# EAGLE design tinyShield (EAGLE 6.5.0)
PART_NUM: EPTIS01401; REV: B; TITLE: tinyISPShield
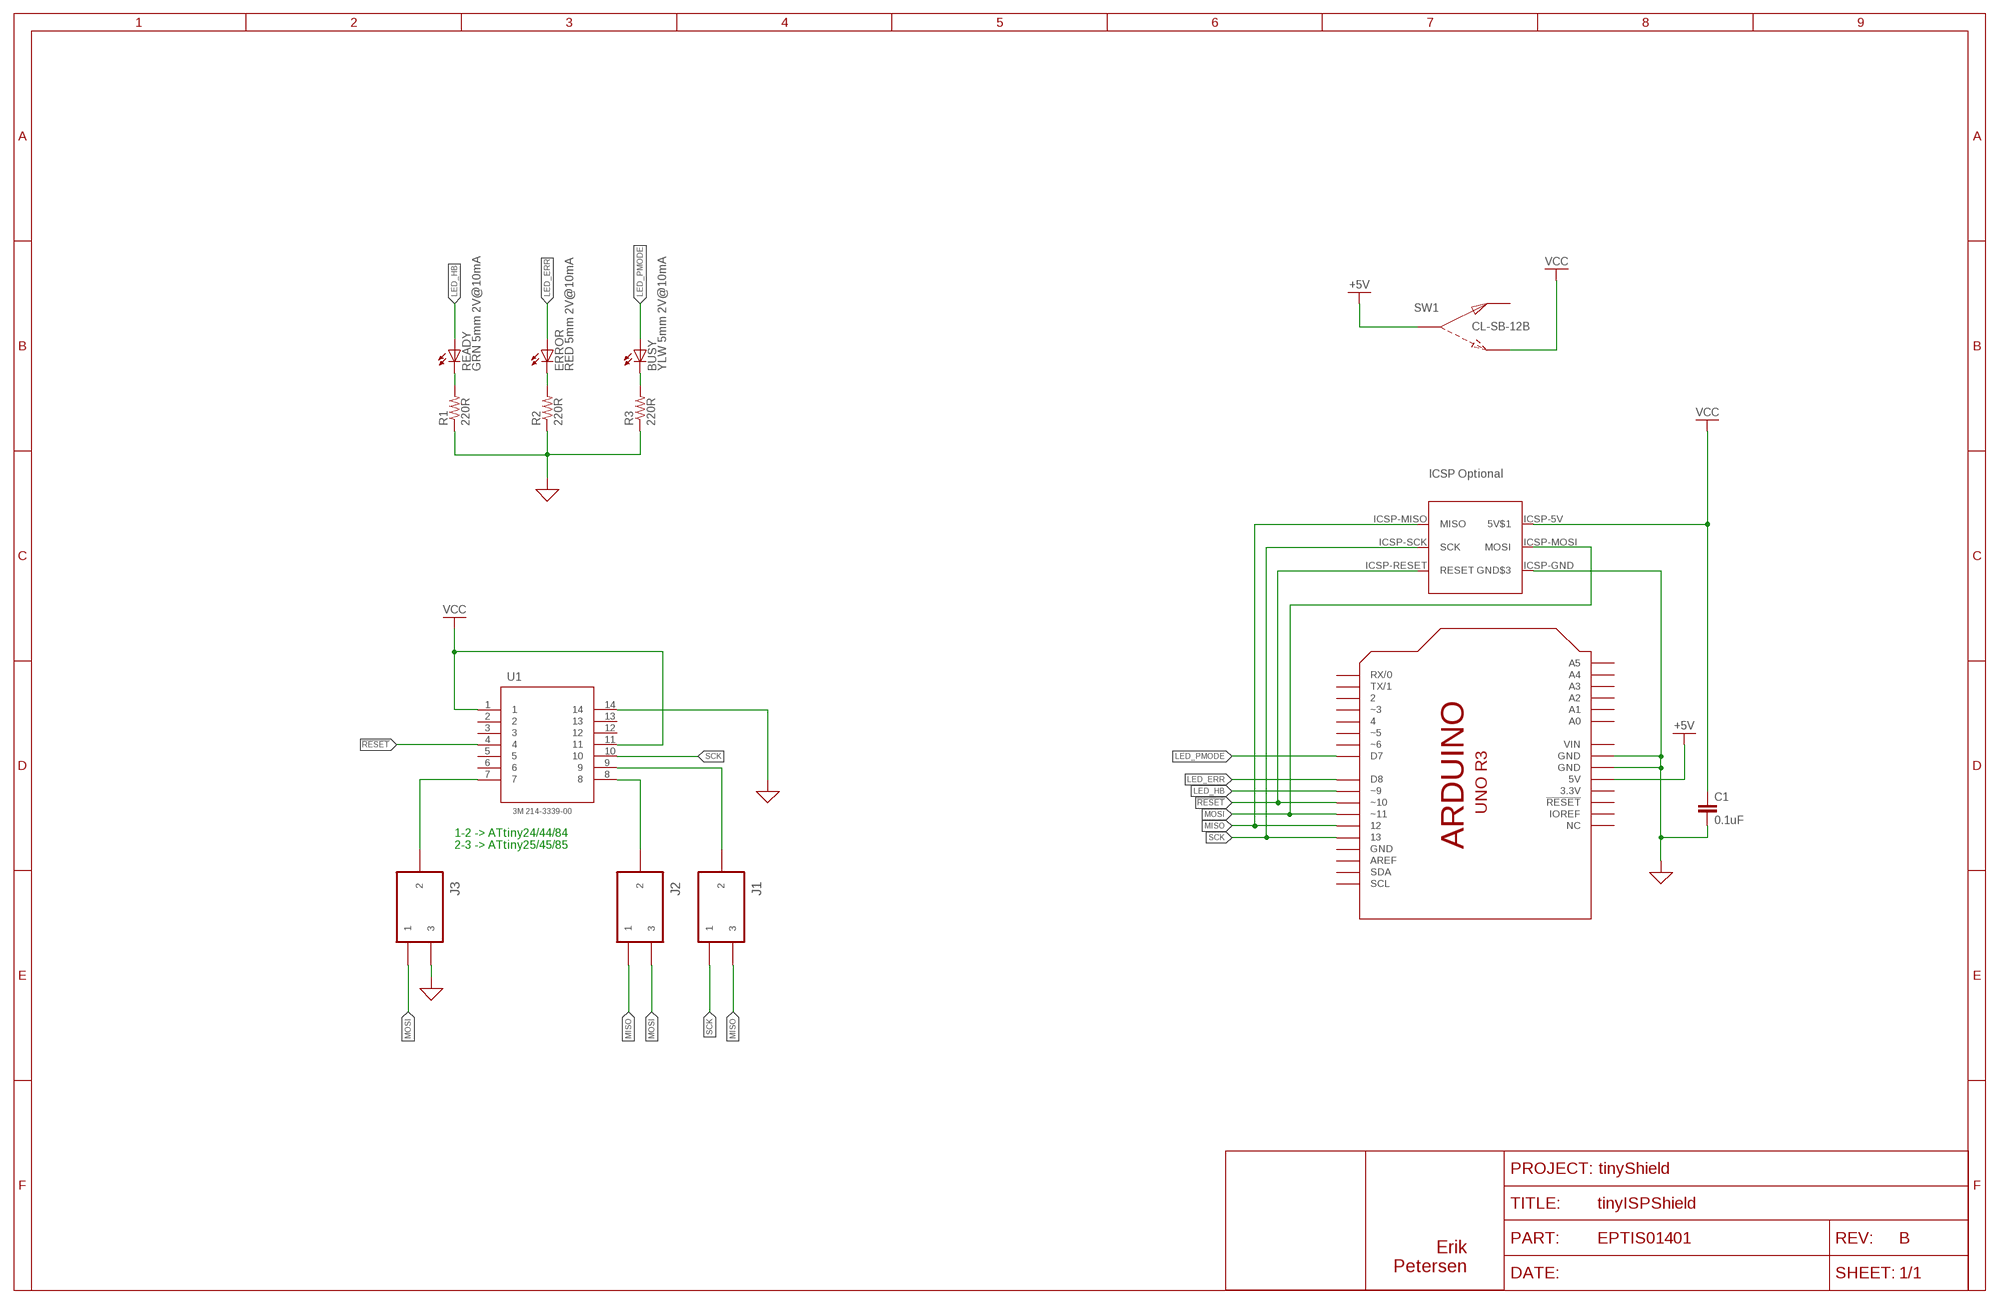
[diagram p0: schematic, sheet 1]

## Parts
BUSY  YLW 5mm 2V@10mA  LED5MM  [LED5MM]
C1  0.1uF  CAPPTH  [CAP-PTH-SMALL]
ERROR  RED 5mm 2V@10mA  LED5MM  [LED5MM]
J1  TSW-103-07-L-SNO_SILK  [1X03_NO_SILK]
J2  TSW-103-07-L-SNO_SILK  [1X03_NO_SILK]
J3  TSW-103-07-L-SNO_SILK  [1X03_NO_SILK]
R1  220R  R-US_0207/10  [0207/10]
R2  220R  R-US_0207/10  [0207/10]
R3  220R  R-US_0207/10  [0207/10]
READY  GRN 5mm 2V@10mA  LED5MM  [LED5MM]
SW1  CL-SB-12B  [CL-SB-12B]
U1  3M 214-3339-00  3M-214-3339  [3M_214_3339]
U$8  ARDUINO_R3_SHIELD  [ARDUINO_SHIELD]

## Nets
!RESET: U1.4 U$8.10(SHIELD:~10) U$8.ICSP-RESET(ICSP:RESET)
+5V: SW1.C U$8.5V(SHIELD:5V)
GND: C1.2 J3.3 R1.1 R2.1 R3.1 U1.14 U$8.GND$2(SHIELD:GND) U$8.GND$3(SHIELD:GND) U$8.ICSP-GND(ICSP:GND$3)
LED_ERR: ERROR.A U$8.8(SHIELD:D8)
LED_HB: READY.A U$8.9(SHIELD:~9)
LED_PMODE: BUSY.A U$8.7(SHIELD:D7)
MISO: J1.3 J2.1 U$8.12 U$8.ICSP-MISO(ICSP:MISO)
MOSI: J2.3 J3.1 U$8.11(SHIELD:~11) U$8.ICSP-MOSI(ICSP:MOSI)
N$1: R1.2 READY.K(C)
N$2: ERROR.K(C) R2.2
N$3: BUSY.K(C) R3.2
N$4: J3.2 U1.7
N$5: J2.2 U1.8
N$6: J1.2 U1.9
SCK: J1.1 U1.10 U$8.13 U$8.ICSP-SCK(ICSP:SCK)
VCC: C1.1 SW1.3 U1.1 U1.11 U$8.ICSP-5V(ICSP:5V$1)
Unconnected: SW1.1 U1.2 U1.3 U1.5 U1.6 U1.12 U1.13 U$8.0(SHIELD:RX/0) U$8.1(SHIELD:TX/1) U$8.2 U$8.3(SHIELD:~3) U$8.4 U$8.5(SHIELD:~5) U$8.6(SHIELD:~6) U$8.A0(SHIELD:A0) U$8.A1(SHIELD:A1) U$8.A2(SHIELD:A2) U$8.A3(SHIELD:A3) U$8.A4(SHIELD:A4) U$8.A5(SHIELD:A5) U$8.AREF(SHIELD:AREF) U$8.IOREF(SHIELD:IOREF) U$8.NC(SHIELD:NC) U$8.RESET(SHIELD:!RESET) U$8.SCL(SHIELD:SCL) U$8.SDA(SHIELD:SDA)

## Notes on the sheet
- ICSP Optional
- 1-2 -> ATtiny24/44/84
  2-3 -> ATtiny25/45/85

## Power pins joined to a net without a drawn wire
3.3V: U$8.3.3V(SHIELD:3.3V)
GND: U$8.GND(SHIELD:GND)
VIN: U$8.VIN(SHIELD:VIN)

## Library data of the parts
BUSY ERROR READY = led:LED: LED OSRAM: - CHIPLED LG R971, LG N971, LY N971, LG Q971, LY Q971, LO R971, LY R971 LH N974, LH R974 LS Q976, LO Q976, LY Q976 LO Q996 - Hyper CHIPLED LW Q18S LB Q993, LB Q99A, LB R99A - SideLED LS A670, LO A670, LY A670, LG A670, LP A670 LB A673, LV A673, LT A673, LW A673 LH A674 LY A675 LS A676, LA A676, LO A676, LY A676, LW A676 LS A679, LY A679, LG A679 - Hyper Micro SIDELED® LS Y876, LA Y876, LO Y876, LY Y876 LT Y87S - SmartLED LW L88C, LW L88S LB L89C, LB L89S, LG L890 LS L89K, LO L89K, LY L89K LS L896, LA L896, LO L896, LY L896 - TOPLED LS T670, LO T670, LY T670, LG T670, LP T670 LSG T670, LSP T670, LSY T670, LOP T670, LYG T670 LG T671, LOG T671, LSG T671 LB T673, LV T673, LT T673, LW T673 LH T674 LS T676, LA T676, LO T676, LY T676, LB T676, LH T676, LSB T676, LW T676 LB T67C, LV T67C, LT T67C, LS T67K, LO T67K, LY T67K, LW E67C LS E67B, LA E67B, LO E67B, LY E67B, LB E67C, LV E67C, LT E67C LW T67C LS T679, LY T679, LG T679 LS T770, LO T770, LY T770, LG T770, LP T770 LB T773, LV T773, LT T773, LW T773 LH T774 LS E675, LA E675, LY E675, LS T675 LS T776, LA T776, LO T776, LY T776, LB T776 LHGB T686 LT T68C, LB T68C - Hyper Mini TOPLED® LB M676 - Mini TOPLED Santana® LG M470 LS M47K, LO M47K, LY M47K Source: http://www.osram.convergy.de LUXEON: - LUMILED® LXK2-PW12-R00, LXK2-PW12-S00, LXK2-PW14-U00, LXK2-PW14-V00 LXK2-PM12-R00, LXK2-PM12-S00, LXK2-PM14-U00 LXK2-PE12-Q00, LXK2-PE12-R00, LXK2-PE12-S00, LXK2-PE14-T00, LXK2-PE14-U00 LXK2-PB12-K00, LXK2-PB12-L00, LXK2-PB12-M00, LXK2-PB14-N00, LXK2-PB14-P00, LXK2-PB14-Q00 LXK2-PR12-L00, LXK2-PR12-M00, LXK2-PR14-Q00, LXK2-PR14-R00 LXK2-PD12-Q00, LXK2-PD12-R00, LXK2-PD12-S00 LXK2-PH12-R00, LXK2-PH12-S00 LXK2-PL12-P00, LXK2-PL12-Q00, LXK2-PL12-R00 Source: www.luxeon.com KINGBRIGHT: KA-3528ASYC Source: www.kingbright.com
C1 = SparkFun-Capacitors:CAP: Capacitor Standard 0603 ceramic capacitor, and 0.1" leaded capacitor.
J1-J3 = C3-Connector:TSW-103-07-L-S: POST HEADER , THROUGH-HOLE
R1-R3 = resistor:R-US_: RESISTOR, American symbol
SW1 = C3-Switches:CL-SB-?: Copal CL-SB Series Slide Switch
U1 = C3-Connector:3M-214-3339: 3M TEXTOOL 0.100" ZIF PDIP-14 Socket
U$8 = C3-General:ARDUINO_R3_SHIELD

## Board
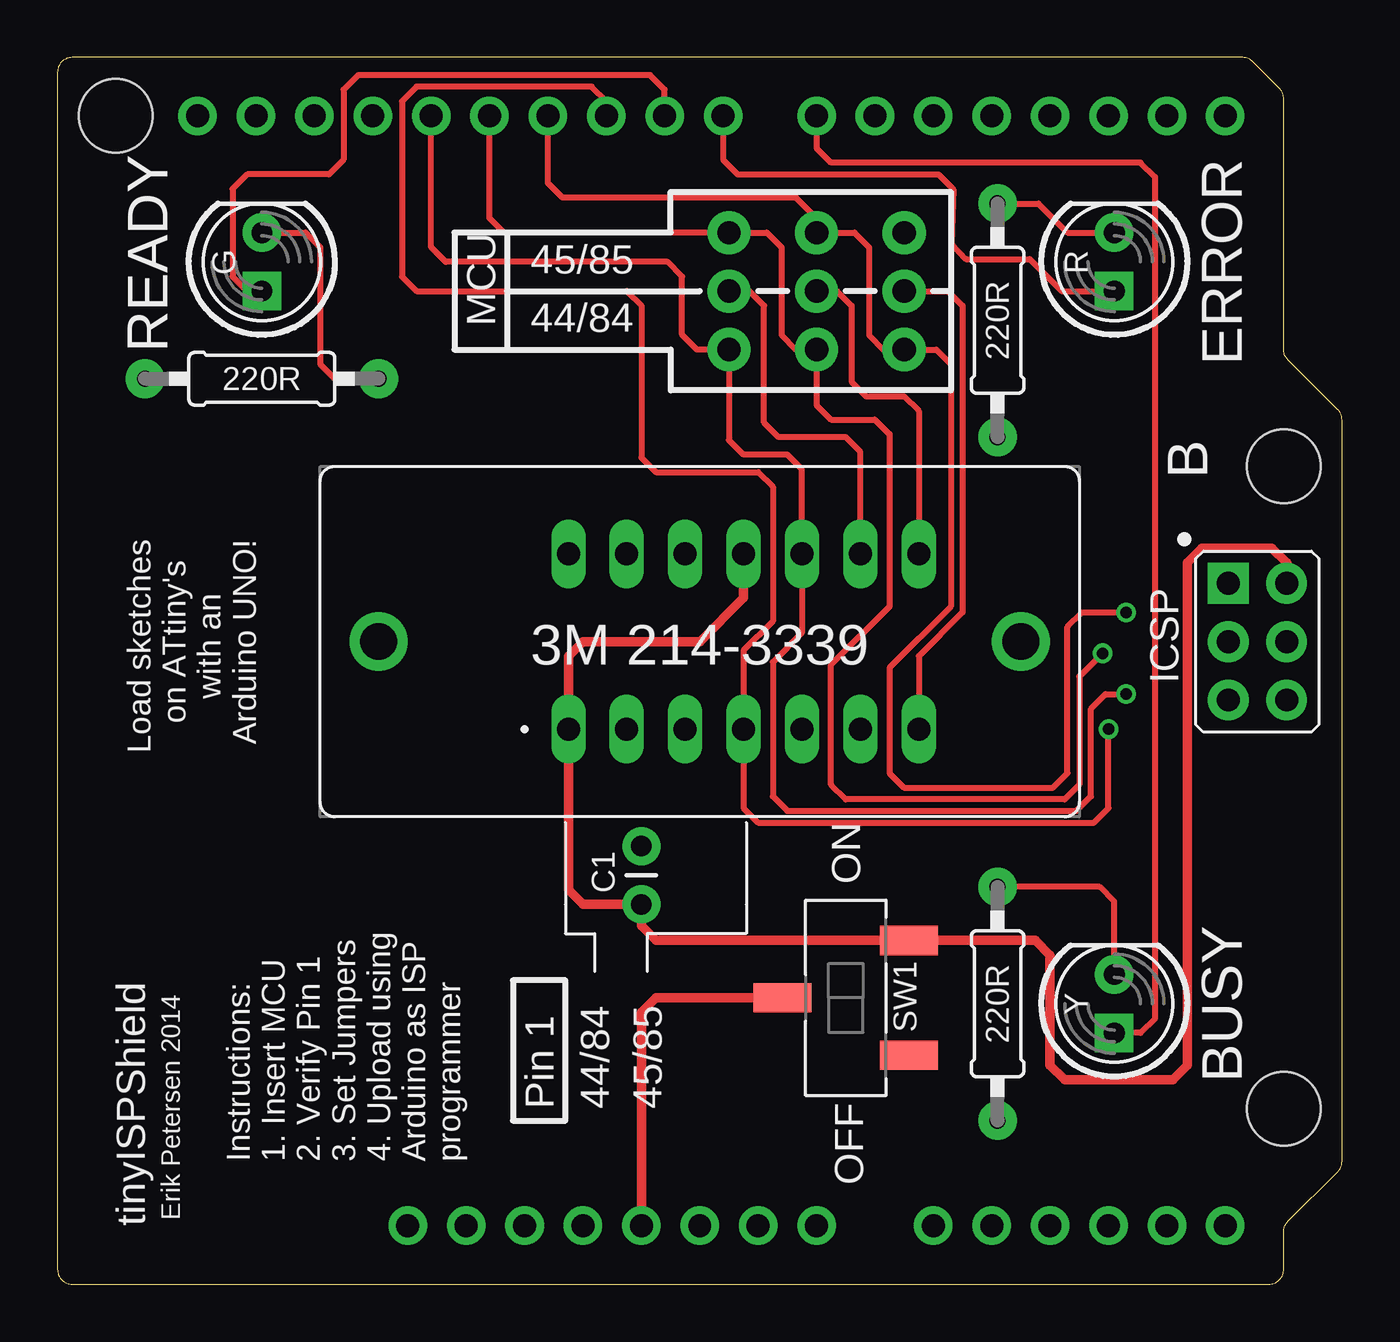
[diagram p1: board, top side]
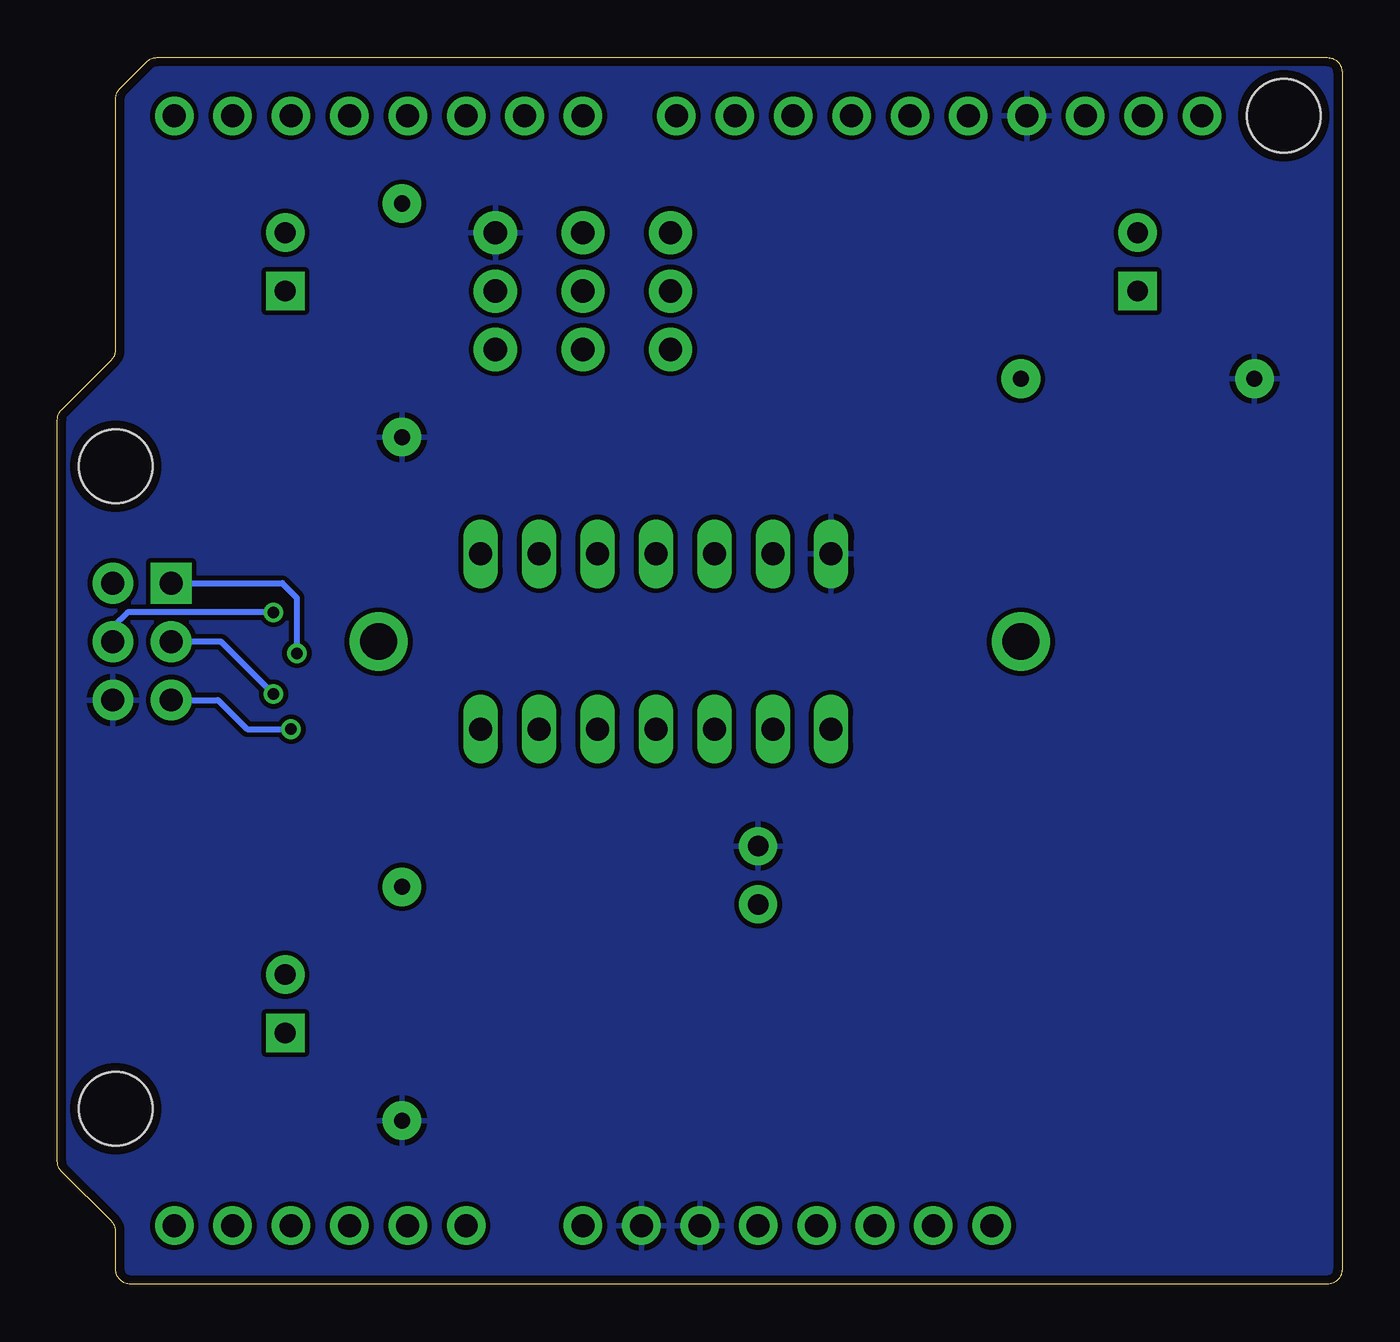
[diagram p2: board, bottom side, seen from below]

Size 55.88 x 53.34 mm. Coordinates in mm from the lower left corner, seen from the top.
Copper layers (1*16): Top 0.0356mm / dielectric 1.5011mm / Bottom 0.0356mm
Design rules "oshPark": minimum track width 6mil, minimum drill 13mil, track to track 0.205mm, track to pad 0.205mm, pad to pad 0.205mm, via to via 0.205mm, smd to smd 6mil, copper to edge 15mil, drill to drill 6mil, minimum pad ring 7mil, minimum via ring 7mil, stop-mask expansion 4mil, vias tented up to drill 0mil, thermal gap 10mil

### Footprints (pad centres in the part's own frame; a part is rotated, then mirrored left to right if it is on the bottom)
LED5MM = drill 0.9 pad 1.676 square: A -1.27,0 | drill 0.9 pad 1.676: K 1.27,0
CAP-PTH-SMALL = drill 0.9 pad 1.651: 1 0,0; 2 2.54,0
1X03_NO_SILK = drill 1.016 pad 1.88: 1 0,0; 2 2.54,0; 3 5.08,0
0207/10 = drill 0.7 pad 1.676: 1 -5.08,0; 2 5.08,0
CL-SB-12B = smd 1.27 x 2.54: 1 -2.5,-2.75; 3 2.5,-2.75; C 0,2.75
3M_214_3339 = drill 1 long: 1 -5.715,-3.81; 2 -3.175,-3.81; 3 -0.635,-3.81; 4 1.905,-3.81; 5 4.445,-3.81; 6 6.985,-3.81; 7 9.525,-3.81; 8 9.525,3.81; 9 6.985,3.81; 10 4.445,3.81; 11 1.905,3.81; 12 -0.635,3.81; 13 -3.175,3.81; 14 -5.715,3.81 | drill 1.6 pad 2.54: P$15 -13.97,0; P$16 13.97,0
ARDUINO_SHIELD = drill 1 pad 1.676: 0 50.8,50.8; 1 48.26,50.8; 2 45.72,50.8; 3 43.18,50.8; 3.3V 22.86,2.54; 4 40.64,50.8; 5 38.1,50.8; 5V 25.4,2.54; 6 35.56,50.8; 7 33.02,50.8; 8 28.956,50.8; 9 26.416,50.8; 10 23.876,50.8; 11 21.336,50.8; 12 18.796,50.8; 13 16.256,50.8; A0 38.1,2.54; A1 40.64,2.54; A2 43.18,2.54; A3 45.72,2.54; A4 48.26,2.54; A5 50.8,2.54; AREF 11.176,50.8; GND 13.716,50.8; GND$2 30.48,2.54; GND$3 27.94,2.54; IOREF 17.78,2.54; NC 15.24,2.54; RESET 20.32,2.54; SCL 6.096,50.8; SDA 8.636,50.8; VIN 33.02,2.54 | drill 1 pad 1.778: ICSP-5V 53.467,30.48; ICSP-GND 53.467,25.4; ICSP-MOSI 53.467,27.94; ICSP-RESET 50.927,25.4; ICSP-SCK 50.927,27.94 | drill 1 pad 1.778 square: ICSP-MISO 50.927,30.48 | hole 3.2: 2.54,50.8; 53.34,35.56; 53.34,7.62

### Placement (x,y rotation side)
BUSY  45.97,12.19 90 top
C1  25.4,16.51 90 top
ERROR  45.97,44.45 90 top
J1  29.21,40.64 90 top
J2  33.02,40.64 90 top
J3  36.83,40.64 90 top
R1  8.89,39.37 0 top
R2  40.89,41.91 90 top
R3  40.89,12.19 90 top
READY  8.89,44.45 90 top
SW1  34.29,12.45 90 top
U1  27.94,27.94 0 top
U$8  0,0 0 top

### Tracks (layer width: path | path; a pad name or v marks a point on that pad's centre or on a via)
!RESET  (via drill 0.5)
  Top 0.254: U$8.10 23.88,51.44 23.24,52.07 15.62,52.07 14.99,51.44 14.99,43.81 15.62,43.18 24.77,43.18 25.4,42.55 25.4,35.94 26.04,35.31 30.48,35.31 31.11,34.67 31.11,28.83 29.84,27.56 U1.4 29.84,20.7 30.48,20.07 45.09,20.07 45.72,20.7 v45.72,24.13
  Bottom 0.254: U$8.ICSP-RESET 48.9,25.4 47.62,24.13 v45.72,24.13
+5V
  Top 0.406: U$8.5V 25.4,11.81 26.04,12.45 SW1.C
GND
  pour Bottom: 0,0 0,52.7 arc-90 0.64,53.34 52.07,53.34 53.34,52.07 53.34,40.9 arc45 53.53,40.45 55.88,38.1 55.88,5.34 arc-45 55.69,4.89 53.34,2.54 53.34,0.64 arc-90 52.7,0
LED_ERR
  Top 0.254: U$8.8 28.96,48.9 29.59,48.26 38.33,48.26 38.97,47.6 38.88,45.23 39.52,44.58 42.29,44.58 43.69,43.18 ERROR.A
LED_HB
  Top 0.254: U$8.9 26.42,51.94 25.78,52.58 13.08,52.58 12.45,51.94 12.45,48.9 11.81,48.26 8.26,48.26 7.62,47.62 7.62,43.81 8.26,43.18 READY.A
LED_PMODE
  Top 0.254: U$8.7 33.02,49.4 33.66,48.77 47.12,48.77 47.75,48.13 47.75,11.56 47.12,10.92 BUSY.A
MISO  (via drill 0.5)
  Top 0.254: U$8.12 18.8,46.35 19.43,45.72 J1.3 30.86,45.72 31.5,45.09 31.5,41.27 32.13,40.64 J2.1 33.02,38.23 33.66,37.59 35.56,37.59 36.2,36.96 36.2,29.46 33.66,26.92 33.66,21.72 34.29,21.08 43.81,21.08 44.45,21.72 44.45,26.42 v45.47,27.43
  Bottom 0.254: U$8.ICSP-MISO 46.1,30.48 45.47,29.84 v45.47,27.43
MOSI  (via drill 0.5)
  Top 0.254: U$8.11 21.34,47.88 21.97,47.24 32.13,47.24 33.02,46.35 J2.3 34.67,45.72 35.31,45.09 35.31,41.27 35.94,40.64 J3.1 38.23,40.64 38.86,40.01 38.86,29.46 36.2,26.8 36.2,22.23 36.83,21.59 43.31,21.59 43.94,22.23 43.94,28.57 44.58,29.21 v46.48,29.21
  Bottom 0.254: v46.48,29.21 52.83,29.21 53.47,28.57 U$8.ICSP-MOSI
N$1
  Top 0.254: READY.K 10.79,45.72 11.43,45.09 11.43,40.01 12.06,39.37 R1.2
N$2
  Top 0.254: R2.2 42.67,46.99 43.94,45.72 ERROR.K
N$3
  Top 0.254: BUSY.K 45.97,16.64 45.34,17.27 R3.2
N$4
  Top 0.254: J3.2 38.73,43.18 39.37,42.55 39.37,29.21 37.47,27.3 U1.7
N$5
  Top 0.254: J2.2 33.91,43.18 34.54,42.55 34.54,39.24 35.18,38.61 36.83,38.61 37.47,37.97 U1.8
N$6
  Top 0.254: J1.2 30.1,43.18 30.73,42.55 30.73,37.47 31.37,36.83 34.29,36.83 34.92,36.2 U1.9
SCK  (via drill 0.5)
  Top 0.254: U$8.13 16.26,45.09 16.89,44.45 26.54,44.45 27.18,43.81 27.18,41.27 27.81,40.64 J1.1 29.21,36.7 29.84,36.07 31.75,36.07 32.38,35.43 U1.10 32.38,28.32 31.11,27.05 31.11,21.21 31.75,20.57 44.32,20.57 44.96,21.21 44.96,25.02 45.59,25.65 v46.48,25.65
  Bottom 0.254: v46.48,25.65 48.77,27.94 U$8.ICSP-SCK
VCC
  Top 0.406: U$8.ICSP-5V 53.47,31.37 52.83,32 49.78,32 49.15,31.37 49.15,9.53 48.51,8.89 43.81,8.89 43.18,9.53 43.18,14.31 42.55,14.95 SW1.3 26.04,14.95 25.4,15.58 C1.1 22.86,16.51 22.23,17.14 U1.1 22.23,27.3 22.86,27.94 27.94,27.94 29.84,29.84 U1.11

### Text on the board
tPlace: G | 45/85 | R | MCU | 220R | 44/84 | 220R | Load sketches / on ATtiny's / with an / Arduino UNO! | ICSP | 3M 214-3339 | ON | 220R | Y | Pin 1 | 44/84 | 45/85 | Instructions: / 1. Insert MCU / 2. Verify Pin 1 / 3. Set Jumpers / 4. Upload using / Arduino as ISP / programmer | OFF | tinyISPShield | Erik Petersen 2014